# Altium project HomeController.PrjPcb
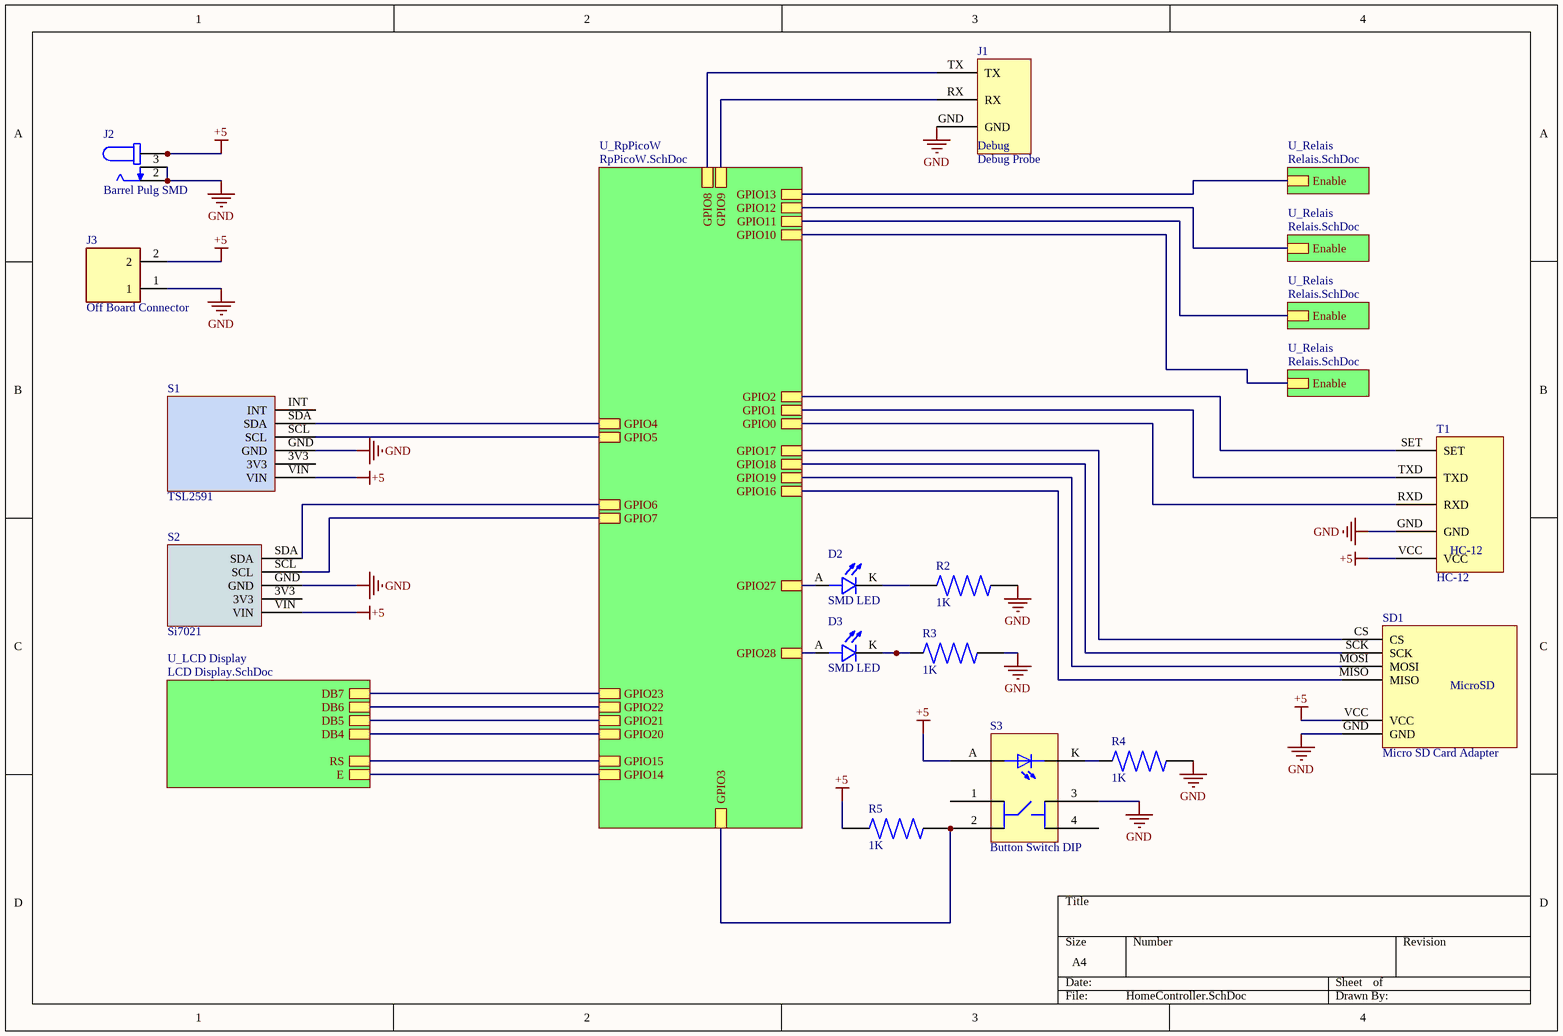
[diagram p0: HomeController.SchDoc]
4 sheets, 48 parts. Net scope: hierarchical (ports join the sheet entries above them; power ports are global).
Board file: HomeController.PcbDoc
Sheets:
  HomeController.SchDoc
    U_RpPicoW = RpPicoW.SchDoc
    U_LCD Display = LCD Display.SchDoc
    U_Relais = Relais.SchDoc
    U_Relais = Relais.SchDoc
    U_Relais = Relais.SchDoc
    U_Relais = Relais.SchDoc

## Sheet HomeController.SchDoc
size A4; SheetNumber: 1; SheetTotal: 4

### Parts
D2  SMD LED  [SMD LED-Footprint-1]
D3  SMD LED  [SMD LED-Footprint-1]
J1  Debug Probe  [Debug Probe-Footprint-1]
J2  Barrel Pulg SMD  [Barrel Pulg SMD-Footprint-1]
J3  Off Board Connector  [Off Board Connector-Footprint-1]
R2  1K  [SMD Resistor-Footprint-1]
R3  1K  [SMD Resistor-Footprint-1]
R4  1K  [SMD Resistor-Footprint-1]
R5  1K  [SMD Resistor-Footprint-1]
S1  TSL2591  [TSL2591-Footprint-1]
S2  Si7021  [Si7021-Footprint-1]
S3  Button Switch DIP  [Button Switch DIP -Footprint-1]
SD1  Micro SD Card Adapter  [Micro SD Card Adapter-Footprint-1]
T1  HC-12  [HC-12-Footprint-1]

### Sub-sheets
U_LCD Display = LCD Display.SchDoc: DB7, DB6, DB5, DB4, RS, E
U_Relais = Relais.SchDoc: Enable
U_Relais = Relais.SchDoc: Enable
U_Relais = Relais.SchDoc: Enable
U_Relais = Relais.SchDoc: Enable
U_RpPicoW = RpPicoW.SchDoc: GPIO0, GPIO1, GPIO2, GPIO3, GPIO4, GPIO5, GPIO6, GPIO7, GPIO8, GPIO9, GPIO10, GPIO11, GPIO12, GPIO13, GPIO14, GPIO15, GPIO16, GPIO17, GPIO18, GPIO19, GPIO20, GPIO21, GPIO22, GPIO23, GPIO27, GPIO28

### Nets
+5: J2.1A J2.1B J3.2 R5.1 S1.VIN S2.VIN S3.A SD1.VCC T1.VCC
GND: J1.GND J2.2 J2.3 J3.1 R2.2 R3.2 R4.2 S1.GND S2.GND S3.3 SD1.GND T1.GND
NetD2_A: D2.A ; sheet U_RpPicoW/GPIO27
NetD2_K: D2.K(C) R2.1
NetD3_A: D3.A ; sheet U_RpPicoW/GPIO28
NetD3_K: D3.K(C) R3.1
NetJ1_RX: J1.RX ; sheet U_RpPicoW/GPIO9
NetJ1_TX: J1.TX ; sheet U_RpPicoW/GPIO8
NetLC1_4: sheet U_RpPicoW/GPIO15, sheet U_LCD Display/RS
NetLC1_6: sheet U_RpPicoW/GPIO14, sheet U_LCD Display/E
NetLC1_11: sheet U_RpPicoW/GPIO20, sheet U_LCD Display/DB4
NetLC1_12: sheet U_RpPicoW/GPIO21, sheet U_LCD Display/DB5
NetLC1_13: sheet U_RpPicoW/GPIO22, sheet U_LCD Display/DB6
NetLC1_14: sheet U_RpPicoW/GPIO23, sheet U_LCD Display/DB7
NetR4_1: R4.1 S3.K
NetR5_2: R5.2 S3.2 ; sheet U_RpPicoW/GPIO3
NetR9_U_Relais1_1: sheet U_RpPicoW/GPIO10, sheet U_Relais/Enable
NetR9_U_Relais2_1: sheet U_RpPicoW/GPIO11, sheet U_Relais/Enable
NetR9_U_Relais3_1: sheet U_RpPicoW/GPIO12, sheet U_Relais/Enable
NetR9_U_Relais4_1: sheet U_RpPicoW/GPIO13, sheet U_Relais/Enable
NetS1_SCL: S1.SCL ; sheet U_RpPicoW/GPIO5
NetS1_SDA: S1.SDA ; sheet U_RpPicoW/GPIO4
NetS2_SCL: S2.SCL ; sheet U_RpPicoW/GPIO7
NetS2_SDA: S2.SDA ; sheet U_RpPicoW/GPIO6
NetSD1_CS: SD1.CS ; sheet U_RpPicoW/GPIO17
NetSD1_MISO: SD1.MISO ; sheet U_RpPicoW/GPIO16
NetSD1_MOSI: SD1.MOSI ; sheet U_RpPicoW/GPIO19
NetSD1_SCK: SD1.SCK ; sheet U_RpPicoW/GPIO18
NetT1_RXD: T1.RXD ; sheet U_RpPicoW/GPIO0
NetT1_SET: T1.SET ; sheet U_RpPicoW/GPIO2
NetT1_TXD: T1.TXD ; sheet U_RpPicoW/GPIO1

Not connected (* = marked no-connect by the designer): S1 3V3 INT; S2 3V3; S3 1 4

### Notes on the sheet
- (in symbol CMP-00026-2) Debug
- (in symbol CMP-00032-2) MicroSD

### Library data of the parts
D2 D3 = CMP-00018-2: Generic SMD LED
J1 = CMP-00026-2: A Connector for the Debug Probe
J2 = CMP-00004-1: SMD Barrel Plug
J3 = CMP-00011-1: 2 Pin
R2-R5 = CMP-00019-2: Generic SMD Resistor
S1 = CMP-00037-1: Adafruit High Dynamic Range Digital Light Sensor
S2 = CMP-00038-1: Adafruit Si7021 Temperature & Humidity Sensor
S3 = CMP-00006-1: 6 Pin with LED
SD1 = CMP-00032-2: SD Card Break Out Board
T1 = CMP-00027-2: UART Telemetry Antenna

## Sheet RpPicoW.SchDoc
size A4; SheetNumber: 2; SheetTotal: 4
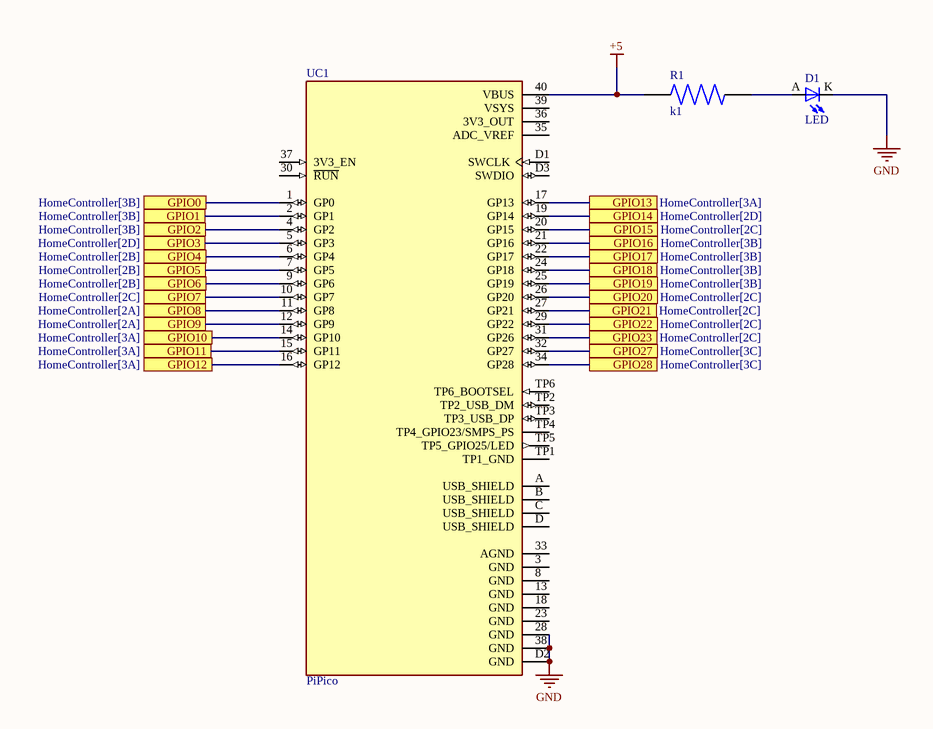
[diagram p1: RpPicoW.SchDoc]

### Parts
D1  LED  [New footprint 1]
R1  k1  [Resistor]
UC1  PiPico  [PiPico]

### Ports
GPIO0 (see HomeController[3B]), GPIO1 (see HomeController[3B]), GPIO2 (see HomeController[3B]), GPIO3 (see HomeController[2D]), GPIO4 (see HomeController[2B]), GPIO5 (see HomeController[2B]), GPIO6 (see HomeController[2B]), GPIO7 (see HomeController[2C]), GPIO8 (see HomeController[2A]), GPIO9 (see HomeController[2A]), GPIO10 (see HomeController[3A]), GPIO11 (see HomeController[3A]), GPIO12 (see HomeController[3A]), GPIO13 (see HomeController[3A]), GPIO14 (see HomeController[2D]), GPIO15 (see HomeController[2C]), GPIO16 (see HomeController[3B]), GPIO17 (see HomeController[3B]), GPIO18 (see HomeController[3B]), GPIO19 (see HomeController[3B]), GPIO20 (see HomeController[2C]), GPIO21 (see HomeController[2C]), GPIO22 (see HomeController[2C]), GPIO23 (see HomeController[2C]), GPIO27 (see HomeController[3C]), GPIO28 (see HomeController[3C])

### Nets
+5: R1.1 UC1.40(VBUS)
GND: D1.K UC1.28(GND) UC1.38(GND) UC1.D2(GND)
NetD1_A: D1.A R1.2
NetD2_A: UC1.32(GP27) ; port GPIO27
NetD3_A: UC1.34(GP28) ; port GPIO28
NetJ1_RX: UC1.12(GP9) ; port GPIO9
NetJ1_TX: UC1.11(GP8) ; port GPIO8
NetLC1_4: UC1.20(GP15) ; port GPIO15
NetLC1_6: UC1.19(GP14) ; port GPIO14
NetLC1_11: UC1.26(GP20) ; port GPIO20
NetLC1_12: UC1.27(GP21) ; port GPIO21
NetLC1_13: UC1.29(GP22) ; port GPIO22
NetLC1_14: UC1.31(GP26) ; port GPIO23
NetR5_2: UC1.5(GP3) ; port GPIO3
NetR9_U_Relais1_1: UC1.14(GP10) ; port GPIO10
NetR9_U_Relais2_1: UC1.15(GP11) ; port GPIO11
NetR9_U_Relais3_1: UC1.16(GP12) ; port GPIO12
NetR9_U_Relais4_1: UC1.17(GP13) ; port GPIO13
NetS1_SCL: UC1.7(GP5) ; port GPIO5
NetS1_SDA: UC1.6(GP4) ; port GPIO4
NetS2_SCL: UC1.10(GP7) ; port GPIO7
NetS2_SDA: UC1.9(GP6) ; port GPIO6
NetSD1_CS: UC1.22(GP17) ; port GPIO17
NetSD1_MISO: UC1.21(GP16) ; port GPIO16
NetSD1_MOSI: UC1.25(GP19) ; port GPIO19
NetSD1_SCK: UC1.24(GP18) ; port GPIO18
NetT1_RXD: UC1.1(GP0) ; port GPIO0
NetT1_SET: UC1.4(GP2) ; port GPIO2
NetT1_TXD: UC1.2(GP1) ; port GPIO1

Not connected (* = marked no-connect by the designer): UC1 3(GND) 8(GND) 13(GND) 18(GND) 23(GND) 30(~{RUN}) 33(AGND) 35(ADC_VREF) 36(3V3_OUT) 37(3V3_EN) 39(VSYS) A(USB_SHIELD) B(USB_SHIELD) C(USB_SHIELD) D(USB_SHIELD) D1(SWCLK) D3(SWDIO) TP1(TP1_GND) TP2(TP2_USB_DM) TP3(TP3_USB_DP) TP4(TP4_GPIO23/SMPS_PS) TP5(TP5_GPIO25/LED) TP6(TP6_BOOTSEL)

### Library data of the parts
D1 = CMP-00001-2: 3mm LED
R1 = Resistor

## Sheet LCD Display.SchDoc
size A4; SheetNumber: 3; SheetTotal: 4
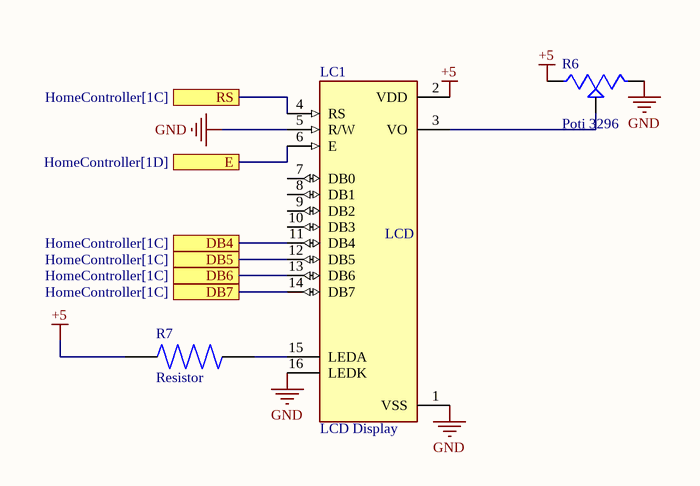
[diagram p2: LCD Display.SchDoc]

### Parts
LC1  LCD Display  [LCD Display-Footprint-1]
R6  Poti 3296  [Poti 3296-Footprint-1]
R7  Resistor  [Resistor-Footprint-1]

### Ports
DB4 (see HomeController[1C]), DB5 (see HomeController[1C]), DB6 (see HomeController[1C]), DB7 (see HomeController[1C]), E (see HomeController[1D]), RS (see HomeController[1C])

### Nets
+5: LC1.2(VDD) R6.1(CCW) R7.1
GND: LC1.1(VSS) LC1.5(R/W) LC1.16(LEDK) R6.3(CW)
NetLC1_3: LC1.3(VO) R6.2(WIPER)
NetLC1_4: LC1.4(RS) ; port RS
NetLC1_6: LC1.6(E) ; port E
NetLC1_11: LC1.11(DB4) ; port DB4
NetLC1_12: LC1.12(DB5) ; port DB5
NetLC1_13: LC1.13(DB6) ; port DB6
NetLC1_14: LC1.14(DB7) ; port DB7
NetLC1_15: LC1.15(LEDA) R7.2

Not connected (* = marked no-connect by the designer): LC1 7(DB0) 8(DB1) 9(DB2) 10(DB3)

### Notes on the sheet
- (in symbol CMP-00030-2) LCD

### Library data of the parts
LC1 = CMP-00030-2: 16x2 LCD Display
R6 = CMP-00013-1: Generic Potentiometer
R7 = CMP-00014-2: Generic Resistor

## Sheet Relais.SchDoc
size A4; SheetNumber: 4; SheetTotal: 4
Used 4 times, as channels U_Relais, U_Relais, U_Relais, U_Relais. Parts and nets are listed once, with the designators drawn on the sheet.
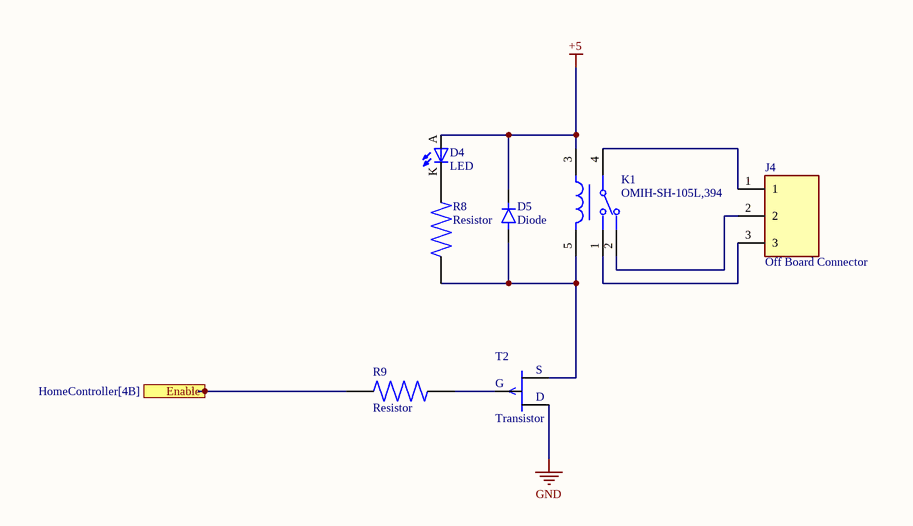
[diagram p3: Relais.SchDoc]

### Parts
D4  LED  [New footprint 1]
D5  Diode  [Diode-Footprint-1]
J4  Off Board Connector  [Off Board Connector-Footprint-1]
K1  OMIH-SH-105L,394  [FP-OMIH-SH-105L_394-MFG]
R8  Resistor  [Resistor-Footprint-1]
R9  Resistor  [Resistor-Footprint-1]
T2  Transistor  [Transistor-Footprint-1]

### Ports
Enable (see HomeController[4B])

### Nets
+5: D4.A D5.K K1.3
GND: T2.2(D)
Enable: R9.1 ; port Enable
NetD4_K: D4.K R8.2
NetD5_A: D5.A K1.5 R8.1 T2.1(S)
NetJ4_1: J4.1 K1.4
NetJ4_2: J4.2 K1.2
NetJ4_3: J4.3 K1.1
NetR9_2: R9.2 T2.3(G)

### Channels
U_Relais: designators end in _U_Relais4; ports Enable=NetR9_U_Relais4_1
U_Relais: designators end in _U_Relais3; ports Enable=NetR9_U_Relais3_1
U_Relais: designators end in _U_Relais2; ports Enable=NetR9_U_Relais2_1
U_Relais: designators end in _U_Relais1; ports Enable=NetR9_U_Relais1_1

### Library data of the parts
D4 = CMP-00001-2: 3mm LED
D5 = CMP-00008-1: Generic Diode
J4 = CMP-00012-1: 3 Pin
K1 = CMP-00036-3: Power/Signal Relay, SPDT, Momentary, 0.108A (Coil), 5VDC (Coil), 540mW (Coil), 16A (Contact), 30VDC (Contact), DC Input, AC/DC Output, Through Hole-Straight Mount
R8 R9 = CMP-00014-2: Generic Resistor
T2 = CMP-00000-1: Generic Transistor

## Nets that join several sheets
+5: HomeController (9 pins), RpPicoW (R1.1 UC1.40), LCD Display (LC1.2 R6.1 R7.1), U_Relais (D4_U_Relais4.A D5_U_Relais4.K K1_U_Relais4.3), U_Relais (D4_U_Relais3.A D5_U_Relais3.K K1_U_Relais3.3), U_Relais (D4_U_Relais2.A D5_U_Relais2.K K1_U_Relais2.3), U_Relais (D4_U_Relais1.A D5_U_Relais1.K K1_U_Relais1.3)
GND: HomeController (12 pins), RpPicoW (D1.K UC1.28 UC1.38 UC1.D2), LCD Display (LC1.1 LC1.5 LC1.16 R6.3), U_Relais (T2_U_Relais4.2), U_Relais (T2_U_Relais3.2), U_Relais (T2_U_Relais2.2), U_Relais (T2_U_Relais1.2)
NetD2_A: HomeController (D2.A), RpPicoW (UC1.32)
NetD3_A: HomeController (D3.A), RpPicoW (UC1.34)
NetJ1_RX: HomeController (J1.RX), RpPicoW (UC1.12)
NetJ1_TX: HomeController (J1.TX), RpPicoW (UC1.11)
NetLC1_4: RpPicoW (UC1.20), LCD Display (LC1.4)
NetLC1_6: RpPicoW (UC1.19), LCD Display (LC1.6)
NetLC1_11: RpPicoW (UC1.26), LCD Display (LC1.11)
NetLC1_12: RpPicoW (UC1.27), LCD Display (LC1.12)
NetLC1_13: RpPicoW (UC1.29), LCD Display (LC1.13)
NetLC1_14: RpPicoW (UC1.31), LCD Display (LC1.14)
NetR5_2: HomeController (R5.2 S3.2), RpPicoW (UC1.5)
NetR9_U_Relais1_1: RpPicoW (UC1.14), U_Relais (R9_U_Relais1.1)
NetR9_U_Relais2_1: RpPicoW (UC1.15), U_Relais (R9_U_Relais2.1)
NetR9_U_Relais3_1: RpPicoW (UC1.16), U_Relais (R9_U_Relais3.1)
NetR9_U_Relais4_1: RpPicoW (UC1.17), U_Relais (R9_U_Relais4.1)
NetS1_SCL: HomeController (S1.SCL), RpPicoW (UC1.7)
NetS1_SDA: HomeController (S1.SDA), RpPicoW (UC1.6)
NetS2_SCL: HomeController (S2.SCL), RpPicoW (UC1.10)
NetS2_SDA: HomeController (S2.SDA), RpPicoW (UC1.9)
NetSD1_CS: HomeController (SD1.CS), RpPicoW (UC1.22)
NetSD1_MISO: HomeController (SD1.MISO), RpPicoW (UC1.21)
NetSD1_MOSI: HomeController (SD1.MOSI), RpPicoW (UC1.25)
NetSD1_SCK: HomeController (SD1.SCK), RpPicoW (UC1.24)
NetT1_RXD: HomeController (T1.RXD), RpPicoW (UC1.1)
NetT1_SET: HomeController (T1.SET), RpPicoW (UC1.4)
NetT1_TXD: HomeController (T1.TXD), RpPicoW (UC1.2)